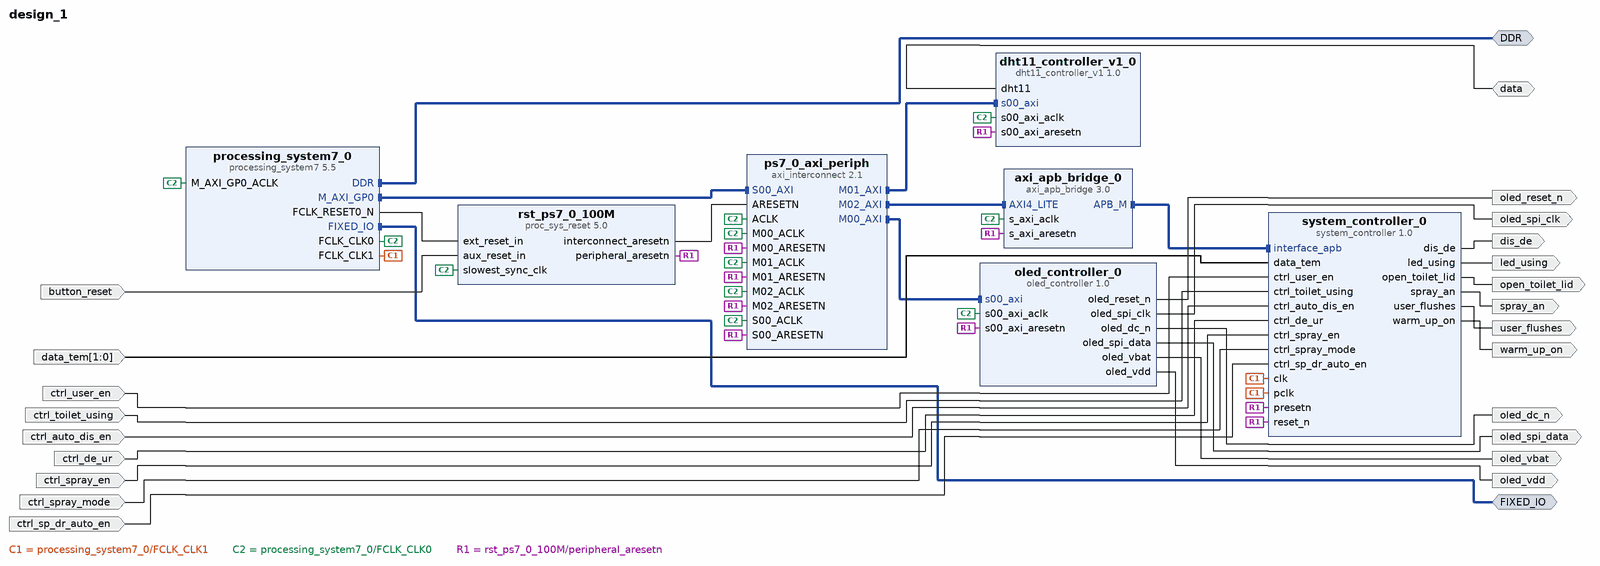
[diagram p0: block diagram of the top level]
# Vivado block design design_1, xc7z020clg484-1, Vivado 2018.1
create_bd_design design_1

create_bd_intf_port -mode Master -vlnv xilinx.com:interface:ddrx_rtl:1.0 DDR
create_bd_intf_port -mode Master -vlnv xilinx.com:display_processing_system7:fixedio_rtl:1.0 FIXED_IO
create_bd_port -dir O -type clk oled_spi_clk
create_bd_port -dir O oled_reset_n
create_bd_port -dir O oled_spi_data
create_bd_port -dir O oled_vdd
create_bd_port -dir O oled_vbat
create_bd_port -dir O oled_dc_n
create_bd_port -dir I -from 1 -to 0 data_tem
create_bd_port -dir I ctrl_user_en
create_bd_port -dir I ctrl_toilet_using
create_bd_port -dir I ctrl_auto_dis_en
create_bd_port -dir I ctrl_de_ur
create_bd_port -dir I ctrl_spray_en
create_bd_port -dir I ctrl_spray_mode
create_bd_port -dir I ctrl_sp_dr_auto_en
create_bd_port -dir O warm_up_on
create_bd_port -dir O open_toilet_lid
create_bd_port -dir O led_using
create_bd_port -dir O spray_an
create_bd_port -dir O user_flushes
create_bd_port -dir O dis_de
create_bd_port -dir I -type rst button_reset
set_property -dict {CONFIG.POLARITY ACTIVE_HIGH} [get_bd_ports button_reset]
create_bd_port -dir IO data

create_bd_cell -type ip -vlnv xilinx.com:ip:processing_system7:5.5 processing_system7_0
set_property -dict [list \
  CONFIG.PCW_FCLK_CLK1_BUF TRUE \
  CONFIG.PCW_UIPARAM_DDR_FREQ_MHZ 533.333313 \
  CONFIG.PCW_APU_PERIPHERAL_FREQMHZ 666.666667 \
  CONFIG.PCW_SDIO_PERIPHERAL_FREQMHZ 50 \
  CONFIG.PCW_UART_PERIPHERAL_FREQMHZ 50 \
  CONFIG.PCW_FPGA0_PERIPHERAL_FREQMHZ 50 \
  CONFIG.PCW_FPGA1_PERIPHERAL_FREQMHZ 10 \
  CONFIG.PCW_EN_CLK1_PORT 1 \
  CONFIG.PCW_PRESET_BANK1_VOLTAGE {LVCMOS 1.8V} \
  CONFIG.PCW_UIPARAM_DDR_PARTNO {MT41J128M16 HA-15E} \
  CONFIG.PCW_QSPI_PERIPHERAL_ENABLE 1 \
  CONFIG.PCW_QSPI_QSPI_IO {MIO 1 .. 6} \
  CONFIG.PCW_QSPI_GRP_SINGLE_SS_ENABLE 1 \
  CONFIG.PCW_QSPI_GRP_SINGLE_SS_IO {MIO 1 .. 6} \
  CONFIG.PCW_SINGLE_QSPI_DATA_MODE x4 \
  CONFIG.PCW_ENET0_PERIPHERAL_ENABLE 1 \
  CONFIG.PCW_ENET0_ENET0_IO {MIO 16 .. 27} \
  CONFIG.PCW_ENET0_GRP_MDIO_ENABLE 1 \
  CONFIG.PCW_ENET0_GRP_MDIO_IO {MIO 52 .. 53} \
  CONFIG.PCW_ENET_RESET_ENABLE 1 \
  CONFIG.PCW_ENET_RESET_SELECT {Share reset pin} \
  CONFIG.PCW_ENET0_RESET_ENABLE 0 \
  CONFIG.PCW_SD0_PERIPHERAL_ENABLE 1 \
  CONFIG.PCW_SD0_SD0_IO {MIO 40 .. 45} \
  CONFIG.PCW_SD0_GRP_CD_ENABLE 1 \
  CONFIG.PCW_SD0_GRP_CD_IO {MIO 47} \
  CONFIG.PCW_SD0_GRP_WP_ENABLE 1 \
  CONFIG.PCW_SD0_GRP_WP_IO {MIO 46} \
  CONFIG.PCW_UART1_PERIPHERAL_ENABLE 1 \
  CONFIG.PCW_UART1_UART1_IO {MIO 48 .. 49} \
  CONFIG.PCW_TTC0_PERIPHERAL_ENABLE 1 \
  CONFIG.PCW_TTC0_TTC0_IO EMIO \
  CONFIG.PCW_USB0_PERIPHERAL_ENABLE 1 \
  CONFIG.PCW_USB0_USB0_IO {MIO 28 .. 39} \
  CONFIG.PCW_USB_RESET_ENABLE 1 \
  CONFIG.PCW_USB_RESET_SELECT {Share reset pin} \
  CONFIG.PCW_USB0_RESET_ENABLE 0 \
  CONFIG.PCW_I2C_RESET_ENABLE 1 \
  CONFIG.PCW_GPIO_MIO_GPIO_ENABLE 1 \
  CONFIG.PCW_GPIO_MIO_GPIO_IO MIO \
  CONFIG.preset ZedBoard \
  CONFIG.PCW_FPGA_FCLK1_ENABLE 1 \
] [get_bd_cells processing_system7_0]
# 224 more settings of processing_system7_0 are not shown: defaults, MIO pin electricals, DDR timing, and values the tool derives
create_bd_cell -type ip -vlnv user.org:user:oled_controller:1.0 oled_controller_0
create_bd_cell -type ip -vlnv xilinx.com:ip:axi_interconnect:2.1 ps7_0_axi_periph
set_property -dict {CONFIG.NUM_MI 3 CONFIG.M01_HAS_REGSLICE 0 CONFIG.M01_HAS_DATA_FIFO 0} [get_bd_cells ps7_0_axi_periph]
create_bd_cell -type ip -vlnv xilinx.com:ip:proc_sys_reset:5.0 rst_ps7_0_100M
create_bd_cell -type ip -vlnv user.org:user:system_controller:1.0 system_controller_0
create_bd_cell -type ip -vlnv xilinx.com:ip:axi_apb_bridge:3.0 axi_apb_bridge_0
set_property -dict {CONFIG.C_APB_NUM_SLAVES 1} [get_bd_cells axi_apb_bridge_0]
create_bd_cell -type ip -vlnv user.org:user:dht11_controller_v1:1.0 dht11_controller_v1_0

# ---- connections ----

connect_bd_intf_net [get_bd_intf_pins processing_system7_0/M_AXI_GP0] [get_bd_intf_pins ps7_0_axi_periph/S00_AXI]
connect_bd_intf_net [get_bd_intf_pins ps7_0_axi_periph/M00_AXI] [get_bd_intf_pins oled_controller_0/s00_axi]
connect_bd_intf_net [get_bd_intf_pins system_controller_0/interface_apb] [get_bd_intf_pins axi_apb_bridge_0/APB_M]
connect_bd_intf_net [get_bd_intf_pins axi_apb_bridge_0/AXI4_LITE] [get_bd_intf_pins ps7_0_axi_periph/M02_AXI]
connect_bd_intf_net [get_bd_intf_pins ps7_0_axi_periph/M01_AXI] [get_bd_intf_pins dht11_controller_v1_0/s00_axi]
connect_bd_intf_net [get_bd_intf_ports DDR] [get_bd_intf_pins processing_system7_0/DDR]
connect_bd_intf_net [get_bd_intf_ports FIXED_IO] [get_bd_intf_pins processing_system7_0/FIXED_IO]
connect_bd_net [get_bd_pins processing_system7_0/FCLK_RESET0_N] [get_bd_pins rst_ps7_0_100M/ext_reset_in]
connect_bd_net [get_bd_pins rst_ps7_0_100M/interconnect_aresetn] [get_bd_pins ps7_0_axi_periph/ARESETN]
connect_bd_net [get_bd_pins oled_controller_0/oled_spi_clk] [get_bd_ports oled_spi_clk]
connect_bd_net [get_bd_pins oled_controller_0/oled_reset_n] [get_bd_ports oled_reset_n]
connect_bd_net [get_bd_pins oled_controller_0/oled_spi_data] [get_bd_ports oled_spi_data]
connect_bd_net [get_bd_pins oled_controller_0/oled_vdd] [get_bd_ports oled_vdd]
connect_bd_net [get_bd_pins oled_controller_0/oled_vbat] [get_bd_ports oled_vbat]
connect_bd_net [get_bd_pins oled_controller_0/oled_dc_n] [get_bd_ports oled_dc_n]
connect_bd_net [get_bd_pins processing_system7_0/FCLK_CLK1] [get_bd_pins system_controller_0/clk] [get_bd_pins system_controller_0/pclk]
connect_bd_net -net data_tem_0_1 [get_bd_ports data_tem] [get_bd_pins system_controller_0/data_tem]
connect_bd_net -net ctrl_user_en_0_1 [get_bd_ports ctrl_user_en] [get_bd_pins system_controller_0/ctrl_user_en]
connect_bd_net -net ctrl_toilet_using_0_1 [get_bd_ports ctrl_toilet_using] [get_bd_pins system_controller_0/ctrl_toilet_using]
connect_bd_net -net ctrl_auto_dis_en_0_1 [get_bd_ports ctrl_auto_dis_en] [get_bd_pins system_controller_0/ctrl_auto_dis_en]
connect_bd_net -net ctrl_de_ur_0_1 [get_bd_ports ctrl_de_ur] [get_bd_pins system_controller_0/ctrl_de_ur]
connect_bd_net -net ctrl_spray_en_0_1 [get_bd_ports ctrl_spray_en] [get_bd_pins system_controller_0/ctrl_spray_en]
connect_bd_net -net ctrl_spray_mode_0_1 [get_bd_ports ctrl_spray_mode] [get_bd_pins system_controller_0/ctrl_spray_mode]
connect_bd_net -net ctrl_sp_dr_auto_en_0_1 [get_bd_ports ctrl_sp_dr_auto_en] [get_bd_pins system_controller_0/ctrl_sp_dr_auto_en]
connect_bd_net [get_bd_pins system_controller_0/warm_up_on] [get_bd_ports warm_up_on]
connect_bd_net [get_bd_pins system_controller_0/open_toilet_lid] [get_bd_ports open_toilet_lid]
connect_bd_net [get_bd_pins system_controller_0/led_using] [get_bd_ports led_using]
connect_bd_net [get_bd_pins system_controller_0/spray_an] [get_bd_ports spray_an]
connect_bd_net [get_bd_pins system_controller_0/user_flushes] [get_bd_ports user_flushes]
connect_bd_net [get_bd_pins system_controller_0/dis_de] [get_bd_ports dis_de]
connect_bd_net -net aux_reset_in_0_1 [get_bd_ports button_reset] [get_bd_pins rst_ps7_0_100M/aux_reset_in]
connect_bd_net [get_bd_pins processing_system7_0/FCLK_CLK0] \
  [get_bd_pins processing_system7_0/M_AXI_GP0_ACLK] [get_bd_pins rst_ps7_0_100M/slowest_sync_clk] \
  [get_bd_pins oled_controller_0/s00_axi_aclk] [get_bd_pins axi_apb_bridge_0/s_axi_aclk] \
  [get_bd_pins dht11_controller_v1_0/s00_axi_aclk] [get_bd_pins ps7_0_axi_periph/S00_ACLK] \
  [get_bd_pins ps7_0_axi_periph/M00_ACLK] [get_bd_pins ps7_0_axi_periph/ACLK] [get_bd_pins ps7_0_axi_periph/M01_ACLK] \
  [get_bd_pins ps7_0_axi_periph/M02_ACLK]
connect_bd_net [get_bd_pins rst_ps7_0_100M/peripheral_aresetn] \
  [get_bd_pins oled_controller_0/s00_axi_aresetn] [get_bd_pins axi_apb_bridge_0/s_axi_aresetn] \
  [get_bd_pins system_controller_0/reset_n] [get_bd_pins system_controller_0/presetn] \
  [get_bd_pins dht11_controller_v1_0/s00_axi_aresetn] [get_bd_pins ps7_0_axi_periph/S00_ARESETN] \
  [get_bd_pins ps7_0_axi_periph/M00_ARESETN] [get_bd_pins ps7_0_axi_periph/M01_ARESETN] \
  [get_bd_pins ps7_0_axi_periph/M02_ARESETN]
connect_bd_net [get_bd_ports data] [get_bd_pins dht11_controller_v1_0/dht11]

# ---- address map ----
assign_bd_address -offset 0x43C00000 -range 64K -target_address_space [get_bd_addr_spaces processing_system7_0/Data] [get_bd_addr_segs oled_controller_0/s00_axi/reg0]
assign_bd_address -offset 0x43C10000 -range 64K -target_address_space [get_bd_addr_spaces processing_system7_0/Data] [get_bd_addr_segs system_controller_0/interface_apb/Reg]
assign_bd_address -offset 0x43C20000 -range 64K -target_address_space [get_bd_addr_spaces processing_system7_0/Data] [get_bd_addr_segs dht11_controller_v1_0/s00_axi/reg0]

validate_bd_design
save_bd_design
